# Altium schematic sheet Leds_parra.SchDoc
size A
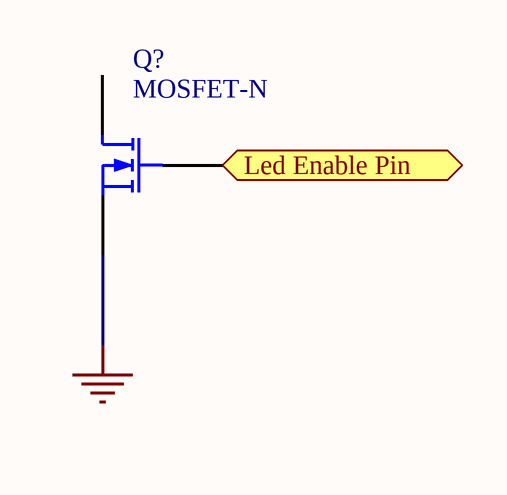
[diagram p0: Leds_parra.SchDoc]

## Parts
Q?  MOSFET-N  [E3]

## Ports
Led Enable Pin (out)

## Nets
GND: Q?.3(S)
Led Enable Pin: Q?.2(G) ; port Led Enable Pin

Not connected (* = marked no-connect by the designer): Q? 1(D)

## Library data of the parts
Q? = MOSFET-N: N-Channel MOSFET; Published: 8-Jun-2000; LatestRevisionDate: 17-Jul-2002; LatestRevisionNote: Re-released for DXP Platform.; PackageVersion: 1995/1996; PackageReference: E3; Publisher: Altium Limited; PackageDescription: TO, Flat Index; 3 In-Line, Axial Leads; Body Dia. 4.6mm; Lead Dia. 0.5 mm (max)